# Altium schematic sheet ADC-EXTERNAL CLOCK INPUT.SchDoc: <SPECIFIC SHEET FUNCTION>
size A3; Date: DO NOT USE, RATHER USE PROJ OPTIONS; DrawnBy: DO NOT USE, RATHER USE PROJ OPTIONS; Engineer: DO NOT USE, RATHER USE PROJ OPTIONS; Organization: DO NOT USE, RATHER USE PROJ OPTIONS; DocumentNumber: 3; Revision: DO NOT USE, RATHER USE PROJ OPTIONS; SheetNumber: 3; SheetTotal: 12; SCH_Sheet_Filename: ADC-EXTERNAL CLOCK INPUT.SchDoc; CurrentTime: DO NOT USE, RATHER USE PROJ OPTIONS; Time: DO NOT USE, RATHER USE PROJ OPTIONS; DocumentFullPathAndName: DO NOT USE, RATHER USE PROJ OPTIONS; DocumentName: DO NOT USE, RATHER USE PROJ OPTIONS; ModifiedDate: DO NOT USE, RATHER USE PROJ OPTIONS; ImagePath: DO NOT USE, RATHER USE PROJ OPTIONS
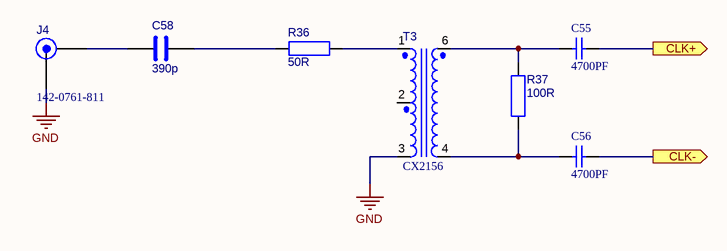
[diagram p0: ADC-EXTERNAL CLOCK INPUT.SchDoc]

## Parts
C55  value 4700PF  [CAPC1005X55N]  (hidden comment: Capacitor 0402 SMD)
C56  value 4700PF  [CAPC1005X55N]  (hidden comment: Capacitor 0402 SMD)
C58  value 390p  [CAPC1005X55N]  (hidden comment: *)
J4  (no value)  [EDGE_LAUNCH_TH_SMA]
R36  50R  [RESC1005X40N]
R37  100R  [RESC1005X40N]
T3  CX2156  [PULSE_KAYAK]

## Ports
CLK+ (out), CLK- (out)

## Nets
GND: J4.2 T3.3
CLK+: C55.2 ; port CLK+
CLK-: C56.2 ; port CLK-
NetC55_1: C55.1 R37.1 T3.6
NetC56_1: C56.1 R37.2 T3.4
NetC58_1: C58.1 J4.1
NetC58_2: C58.2 R36.1
NetR36_2: R36.2 T3.1

Not connected (* = marked no-connect by the designer): T3 2

## Notes on the sheet
- 2009   THIS DOCUMENT IS THE PROPERTY OF THE OWNER, AND MAY NOT BE COPIED OR USED FOR ANY PURPOSE OTHER THAN THAT FOR WHICH IT IS SUPPLIED WITHOUT PERMISSION IN WRITING FROM THE OWNER.
- C
- DATESTAMP OF THIS PRINT
- DRAWN BY:
- DOCUMENT NUMBER:
- SCHEMATIC FILENAME:
- PCB FILENAME:
- ENGINEER:
- APPROVED:
- CIRCUIT DIAGRAM
- DATE
- SHEET
- REVISION
- OF

## Library data of the parts
C55 C56 = cap0402: Created_By: EDA-ASA; Checked_By: *; Checked_Date: *; HelpURL: *; Supplier1: *; Supplier2: *; Unit_Cost: *; MOQ: *; Leadtime: *; Inventory_Stock: *; Tolerance: *; Wattage: *; Package: 0402; ComponentLinked1Description: *; ComponentLinked1URL: *; ComponentLinked2Description: *; ComponentLinked2URL: *; ComponentLinked3Description: *; ComponentLinked3URL: *; ComponentLinked4Description: *; ComponentLinked4URL: *
C58 = CAP-0603: CAP SMD 0603; Manufacturer: *; Manufacturer_PN: *; Created_By: *; Checked_By: *; Checked_Date: *; HelpURL: *; ComponentLink1Description: Footprint Detail; ComponentLink1URL: *; ComponentLink2Description: Application Note; ComponentLink2URL: *; ComponentLink3Description: Layout Guidelines; ComponentLink3URL: *; ComponentLink4Description: Technology Reference; ComponentLink4URL: *; Supplier1: *; Supplier2: *; Unit_Cost: *; MOQ: *; Leadtime: *; Inventory_Stock: *; Tolerance: *; Wattage: *; Voltage: *; Package: 0603; ComponentLink5Description: Production Detail; ComponentLink5URL: *; Note: *; Stock Code: *
J4 = 142-0761-811: High Frequency SMA End Lauch Connector; Manufacturer: JOHNSON; Created_By: CT; Voltage: ???; Checked_By: *; Checked_Date: *; HelpURL: *; ComponentLink1Description: High Frequency SMA End Lauch Connector; ComponentLink1URL: *; ComponentLink2Description: Application Note; ComponentLink2URL: *; ComponentLink3Description: Layout Guidelines; ComponentLink3URL: *; ComponentLink4Description: Technology Reference; ComponentLink4URL: *; Supplier1: *; Supplier2: *; Unit_Cost: *; MOQ: *; Leadtime: *; Inventory_Stock: *; Tolerance: *; Wattage: *; Package: *; ComponentLink5Description: Production Detail; ComponentLink5URL: *; Note: *; Stock Code: *; Manufacturer_PN: 142-0761-811
R36 R37 = RES-0805: RESISTOR SMD 0805; Checked_By: NN; Manufacturer: *; Manufacturer_PN: *; Created_By: *; Checked_Date: 5-08-2009; HelpURL: *; ComponentLink1Description: Footprint Detail; ComponentLink1URL: *; ComponentLink2Description: Application Note; ComponentLink2URL: *; ComponentLink3Description: Layout Guidelines; ComponentLink3URL: *; ComponentLink4Description: Technology Reference; ComponentLink4URL: *; Supplier1: *; Supplier2: *; Unit_Cost: *; MOQ: *; Leadtime: *; Inventory_Stock: *; Tolerance: *; Wattage: *; Voltage: *; Package: 0805; ComponentLink5Description: Production Detail; ComponentLink5URL: *; Note: *; Stock Code: *
  R36: Value: 50R
  R37: Value: 100R
T3 = CX2156: TRANSFORMER WIDEBAND RF APPLICATION; Voltage: ???; Manufacturer: *; Created_By: *; Checked_By: *; Checked_Date: *; HelpURL: *; ComponentLink1Description: TRANSFORMER WIDEBAND RF APPLICATION; ComponentLink1URL: *; ComponentLink2Description: Application Note; ComponentLink2URL: *; ComponentLink3Description: Layout Guidelines; ComponentLink3URL: *; ComponentLink4Description: Technology Reference; ComponentLink4URL: *; Supplier1: *; Supplier2: *; Unit_Cost: *; MOQ: *; Leadtime: *; Inventory_Stock: *; Tolerance: *; Wattage: *; Package: *; ComponentLink5Description: Production Detail; ComponentLink5URL: *; Note: *; Stock Code: *; Manufacturer_PN: CX2156